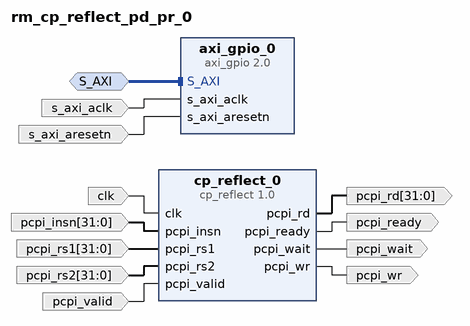
[diagram p0: block diagram of the top level]
# Vivado block design rm_cp_reflect_pd_pr_0, xc7z020clg400-1, Vivado 2018.2
create_bd_design rm_cp_reflect_pd_pr_0

create_bd_intf_port -mode Slave -vlnv xilinx.com:interface:aximm_rtl:1.0 S_AXI
set_property -dict [list \
  CONFIG.DATA_WIDTH 32 \
  CONFIG.PROTOCOL AXI4LITE \
  CONFIG.ID_WIDTH 0 \
  CONFIG.ADDR_WIDTH 9 \
  CONFIG.AWUSER_WIDTH 0 \
  CONFIG.ARUSER_WIDTH 0 \
  CONFIG.WUSER_WIDTH 0 \
  CONFIG.RUSER_WIDTH 0 \
  CONFIG.BUSER_WIDTH 0 \
  CONFIG.READ_WRITE_MODE READ_WRITE \
  CONFIG.HAS_BURST 0 \
  CONFIG.HAS_LOCK 0 \
  CONFIG.HAS_PROT 0 \
  CONFIG.HAS_CACHE 0 \
  CONFIG.HAS_QOS 0 \
  CONFIG.HAS_REGION 0 \
  CONFIG.HAS_WSTRB 1 \
  CONFIG.HAS_BRESP 1 \
  CONFIG.HAS_RRESP 1 \
  CONFIG.SUPPORTS_NARROW_BURST 0 \
  CONFIG.NUM_READ_OUTSTANDING 1 \
  CONFIG.NUM_WRITE_OUTSTANDING 1 \
  CONFIG.MAX_BURST_LENGTH 1 \
  CONFIG.NUM_READ_THREADS 1 \
  CONFIG.NUM_WRITE_THREADS 1 \
  CONFIG.RUSER_BITS_PER_BYTE 0 \
  CONFIG.WUSER_BITS_PER_BYTE 0 \
] [get_bd_intf_ports S_AXI]
create_bd_port -dir I -type clk clk
set_property -dict {CONFIG.FREQ_HZ 100000000 CONFIG.CLK_DOMAIN cp_reflect_clk} [get_bd_ports clk]
create_bd_port -dir I -from 31 -to 0 pcpi_insn
create_bd_port -dir O -from 31 -to 0 pcpi_rd
create_bd_port -dir O pcpi_ready
create_bd_port -dir I -from 31 -to 0 pcpi_rs1
create_bd_port -dir I -from 31 -to 0 pcpi_rs2
create_bd_port -dir I pcpi_valid
create_bd_port -dir O pcpi_wait
create_bd_port -dir O pcpi_wr
create_bd_port -dir I -type clk s_axi_aclk
set_property -dict {CONFIG.FREQ_HZ 100000000} [get_bd_ports s_axi_aclk]
create_bd_port -dir I -type rst s_axi_aresetn

create_bd_cell -type ip -vlnv xilinx.com:ip:axi_gpio:2.0 axi_gpio_0
create_bd_cell -type ip -vlnv colindrewes.com:colindrewes:cp_reflect:1.0 cp_reflect_0

# ---- connections ----

connect_bd_intf_net [get_bd_intf_ports S_AXI] [get_bd_intf_pins axi_gpio_0/S_AXI]
connect_bd_net [get_bd_ports clk] [get_bd_pins cp_reflect_0/clk]
connect_bd_net [get_bd_pins cp_reflect_0/pcpi_rd] [get_bd_ports pcpi_rd]
connect_bd_net [get_bd_pins cp_reflect_0/pcpi_ready] [get_bd_ports pcpi_ready]
connect_bd_net [get_bd_pins cp_reflect_0/pcpi_wait] [get_bd_ports pcpi_wait]
connect_bd_net [get_bd_pins cp_reflect_0/pcpi_wr] [get_bd_ports pcpi_wr]
connect_bd_net [get_bd_ports pcpi_insn] [get_bd_pins cp_reflect_0/pcpi_insn]
connect_bd_net -net pcpi_rs1_1 [get_bd_ports pcpi_rs1] [get_bd_pins cp_reflect_0/pcpi_rs1]
connect_bd_net -net pcpi_rs2_1 [get_bd_ports pcpi_rs2] [get_bd_pins cp_reflect_0/pcpi_rs2]
connect_bd_net [get_bd_ports pcpi_valid] [get_bd_pins cp_reflect_0/pcpi_valid]
connect_bd_net [get_bd_ports s_axi_aclk] [get_bd_pins axi_gpio_0/s_axi_aclk]
connect_bd_net [get_bd_ports s_axi_aresetn] [get_bd_pins axi_gpio_0/s_axi_aresetn]

# ---- address map ----
assign_bd_address -offset 0x0000 -range 4K -target_address_space [get_bd_addr_spaces S_AXI] [get_bd_addr_segs axi_gpio_0/S_AXI/Reg]

validate_bd_design
save_bd_design
